# EasyEDA Pro project SCH.epro

# Schematic 【蓝桥杯练习题一】51单片机开发板
Board Name: 【蓝桥杯练习题一】51单片机开发板; Create Date: 2024-11-07; Page Name: SCH; Project Name: 第十三届 蓝桥杯EDA 模拟赛题; Schematic Name: 【蓝桥杯练习题一】51单片机开发板; Update Date: 2024-11-07; Add into BOM: yes; Company: 嘉立创EDA; Convert to PCB: yes; Date: 2020-08-01; Draw By: LCEDA_01; REV: 1.0; Sheet: 1/1
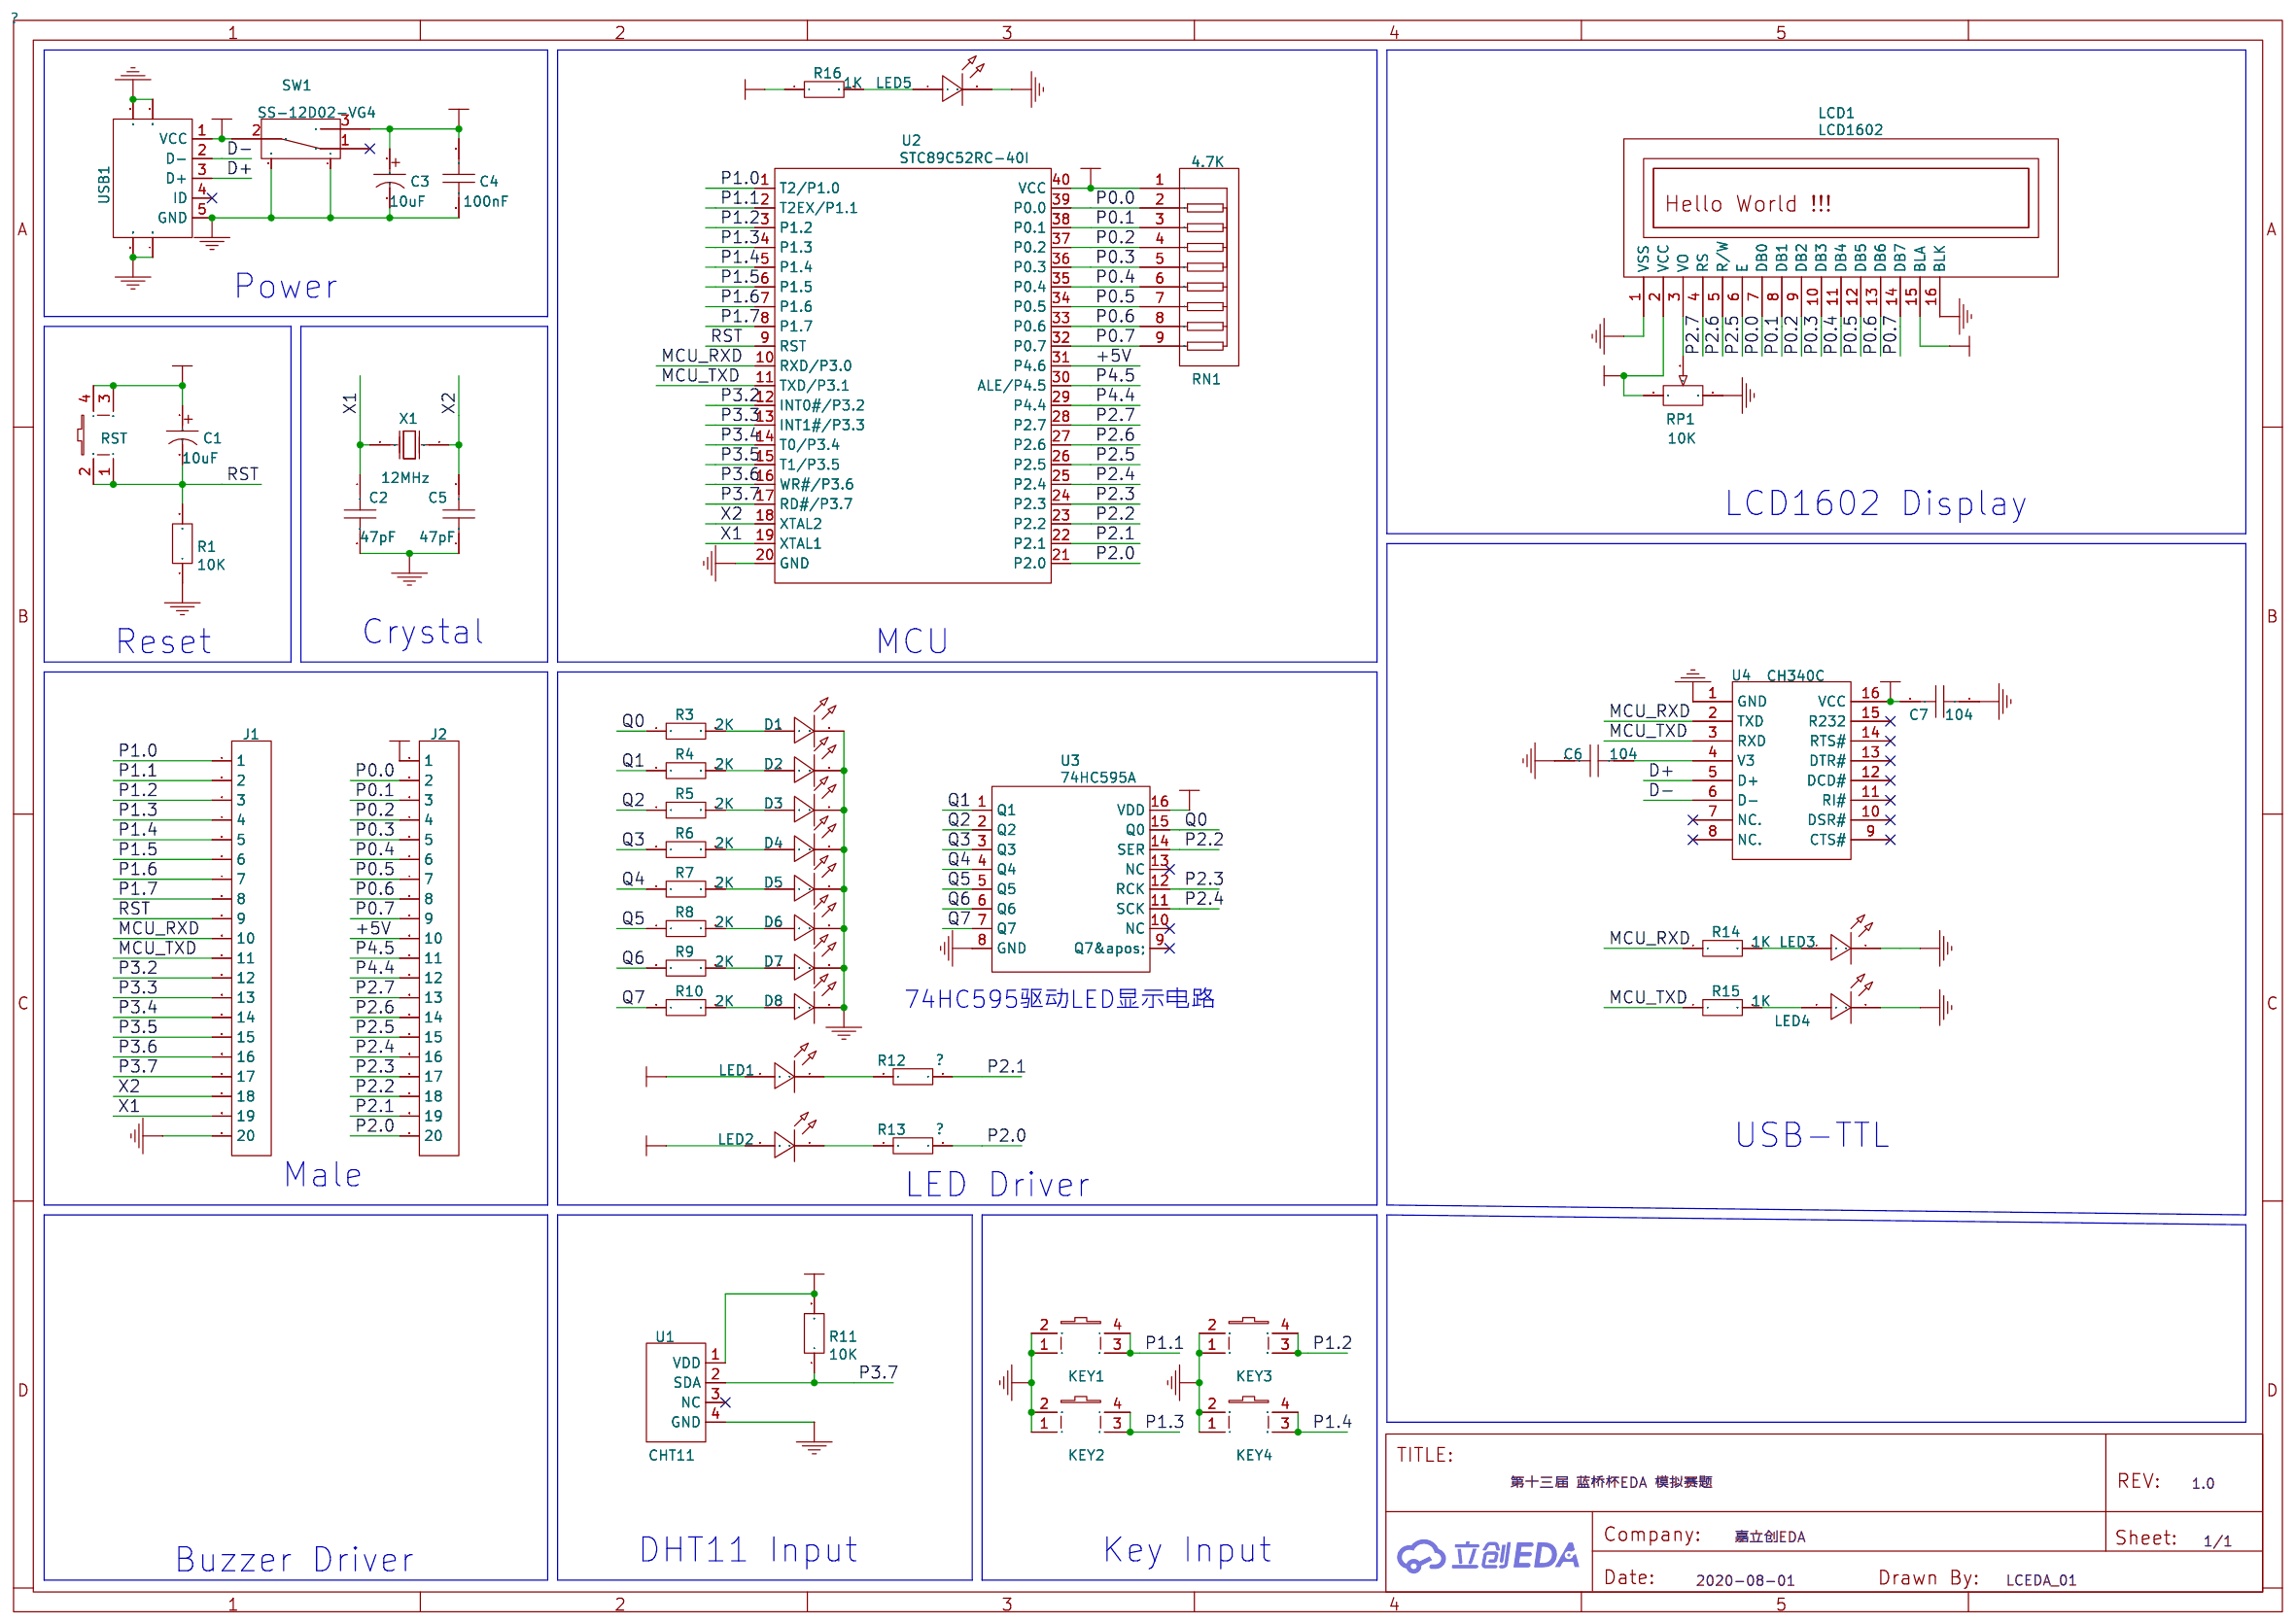
[diagram p0: schematic sheet]

## Parts
C1  10uF
C2  47pF
C3  10uF
C4  100nF
C5  47pF
C6  104
C7  104
D1  LED-0805_B
D2  LED-0805_B
D3  LED-0805_B
D4  LED-0805_B
D5  LED-0805_B
D6  LED-0805_B
D7  LED-0805_B
D8  LED-0805_B
J1  HDR-M-2.54_1x20
J2  HDR-M-2.54_1x20
KEY1  K4-6×6_SMD
KEY2  K4-6×6_SMD
KEY3  K4-6×6_SMD
KEY4  K4-6×6_SMD
LCD1  LCD1602
LED1  LED-TH-3mm_B
LED2  LED-TH-3mm_G
LED3  LED-0805_B
LED4  LED-0805_G
LED5  LED-TH-3mm_R
R1  10K
R3  2K
R4  2K
R5  2K
R6  2K
R7  2K
R8  2K
R9  2K
R10  2K
R11  10K
R12  ？
R13  ？
R14  1K
R15  1K
R16  1K
RN1  4.7K
RP1  10K
RST  K4-6×6_SMD
SW1  SS-12D02-VG4
U1  CHT11
U2  STC89C52RC-40I
U3  74HC595A
U4  CH340C
USB1  USB-Micro_2
X1  12MHz

## Library data of the parts
C1 C3 = 10uF 25V 5*11: Supplier: LCSC; Manufacturer: ValuePro; Supplier Part: C43347
C2 C5 = CC81-N5S2L1B470KSE: Supplier: LCSC; Supplier Part: C278007; Manufacturer: Guangdong Fenghua Advanced Tech
C4 C6 C7 = CC1H104ZA1FD3F5O10MF: Supplier: LCSC; Supplier Part: C254088; Manufacturer: Dersonic
D1-D8 LED3 = D-B080508B1-KS2: Manufacturer: 方舟 ARKLED; Supplier Part: C108412
J1 J2 = HDR-M-2.54_1x20: Supplier Part: C50981; Supplier: LCSC
KEY1-KEY4 RST = K2-6639SP-D4SC-04: Supplier Part: C191626; Supplier: LCSC; Manufacturer: 韩国韩荣
LCD1 = LCM1602K-NSW-BBW: Manufacturer: LONTECH(厦门龙特); Supplier Part: C83275; Supplier: LCSC
LED1 = 204-10SUBC/S400-A4: Manufacturer: EVERLIGHT(台湾亿光); Supplier Part: C86881; Supplier: LCSC
LED2 = 204-10SYGD/S530-E3: Manufacturer: EVERLIGHT(台湾亿光); Supplier Part: C85161
LED4 = NCD0805G1: Manufacturer: 国星光电; Supplier Part: C84260
LED5 = 204-10SDRD/S530-A3-L: Manufacturer: EVERLIGHT(台湾亿光); Supplier Part: C84774; Supplier: LCSC
R1 R11 = RN 1/4W 10K F T/B A1: Supplier: LCSC; Supplier Part: C410695; Manufacturer: TyoHM
R3-R10 R14 R15 = ARG05FTC2001: Supplier: LCSC; Supplier Part: C218483; Manufacturer: Viking Tech; JLCPCB Part Class: Extended Part
R12 R13 R16 = RN1/2WS2KΩFT/BA1: Supplier: LCSC; Supplier Part: C385487; Manufacturer: TyoHM
RN1 = A09-472JP: Supplier: LCSC; Manufacturer: FH; Supplier Part: C9112
RP1 = 10K: Supplier: LCSC; Value(Ω): 10k
SW1 = SS-12D02-VG4: Supplier: LCSC; Supplier Part: C136719; Manufacturer: Rectangular Connectors - Contacts
U1 = CHT11: Supplier: LCSC; Supplier Part: C476208; Manufacturer: CYBERSEN; JLCPCB Part Class: Extended Part
U2 = STC89C52RC-40I: Supplier: LCSC; Manufacturer: STC; image: //image.lceda.cn/szlcsc/C14022.jpg; Supplier Part: C14022
U3 = 74HC595A: Supplier: LCSC; Manufacturer: FM; Supplier Part: C110383; JLCPCB Part Class: Extended Part
U4 = CH340C: Supplier: LCSC; Manufacturer: WCH; Supplier Part: C84681; JLCPCB Part Class: Extend
USB1 = USB-Micro_2: Supplier Part: C40957; Supplier: LCSC; Manufacturer: ValuePro
X1 = B12000J233: Supplier: LCSC; Supplier Part: C258979; Manufacturer: ZheJiang East Crystal Elec

## Nets
+5V: C1.1 C3.1 C4.2 J2.1 J2.10 LCD1.2(VCC) LCD1.15(BLA) LED1.1 LED2.1 R11.2 R16.1 RN1.1 RP1.1 RST.3 RST.4 SW1.3 U1.1(VDD) U2.31(P4.6) U2.40(VCC) U3.16(VDD)
GND: C2.2 C3.2 C4.1 C5.1 C6.2 C7.1 D1.2 D2.2 D3.2 D4.2 D5.2 D6.2 D7.2 D8.2 J1.20 KEY1.1 KEY1.2 KEY2.1 KEY2.2 KEY3.1 KEY3.2 KEY4.1 KEY4.2 LCD1.1(VSS) LCD1.16(BLK) LED3.2 LED4.2 LED5.2 R1.1 RP1.3 SW1.4 SW1.5 U1.4(GND) U2.20(GND) U3.8(GND) U4.1(GND) USB1.5(GND) USB1.6(SH3) USB1.7(SH4) USB1.8(SH1) USB1.9(SH2)
VCC: C7.2 SW1.2 U4.16(VCC) USB1.1(VCC)
D+: U4.5(D+) USB1.3(D+)
D-: U4.6(D-) USB1.2(D-)
MCU_RXD: J1.10 R14.1 U2.10(RXD/P3.0) U4.2(TXD)
MCU_TXD: J1.11 R15.1 U2.11(TXD/P3.1) U4.3(RXD)
P0.0: J2.2 LCD1.7(DB0) RN1.2 U2.39(P0.0)
P0.1: J2.3 LCD1.8(DB1) RN1.3 U2.38(P0.1)
P0.2: J2.4 LCD1.9(DB2) RN1.4 U2.37(P0.2)
P0.3: J2.5 LCD1.10(DB3) RN1.5 U2.36(P0.3)
P0.4: J2.6 LCD1.11(DB4) RN1.6 U2.35(P0.4)
P0.5: J2.7 LCD1.12(DB5) RN1.7 U2.34(P0.5)
P0.6: J2.8 LCD1.13(DB6) RN1.8 U2.33(P0.6)
P0.7: J2.9 LCD1.14(DB7) RN1.9 U2.32(P0.7)
P1.0: J1.1 U2.1(T2/P1.0)
P1.1: J1.2 KEY1.3 KEY1.4 U2.2(T2EX/P1.1)
P1.2: J1.3 KEY3.3 KEY3.4 U2.3(P1.2)
P1.3: J1.4 KEY2.3 KEY2.4 U2.4(P1.3)
P1.4: J1.5 KEY4.3 KEY4.4 U2.5(P1.4)
P1.5: J1.6 U2.6(P1.5)
P1.6: J1.7 U2.7(P1.6)
P1.7: J1.8 U2.8(P1.7)
P2.0: J2.20 R13.2 U2.21(P2.0)
P2.1: J2.19 R12.2 U2.22(P2.1)
P2.2: J2.18 U2.23(P2.2) U3.14(SER)
P2.3: J2.17 U2.24(P2.3) U3.12(RCK)
P2.4: J2.16 U2.25(P2.4) U3.11(SCK)
P2.5: J2.15 LCD1.6(E) U2.26(P2.5)
P2.6: J2.14 LCD1.5(R/W) U2.27(P2.6)
P2.7: J2.13 LCD1.4(RS) U2.28(P2.7)
P3.2: J1.12 U2.12(INT0#/P3.2)
P3.3: J1.13 U2.13(INT1#/P3.3)
P3.4: J1.14 U2.14(T0/P3.4)
P3.5: J1.15 U2.15(T1/P3.5)
P3.6: J1.16 U2.16(WR#/P3.6)
P3.7: J1.17 R11.1 U1.2(SDA) U2.17(RD#/P3.7)
P4.4: J2.12 U2.29(P4.4)
P4.5: J2.11 U2.30(ALE/P4.5)
Q0: R3.1 U3.15(Q0)
Q1: R4.1 U3.1(Q1)
Q2: R5.1 U3.2(Q2)
Q3: R6.1 U3.3(Q3)
Q4: R7.1 U3.4(Q4)
Q5: R8.1 U3.5(Q5)
Q6: R9.1 U3.6(Q6)
Q7: R10.1 U3.7(Q7)
RST: C1.2 J1.9 R1.2 RST.1 RST.2 U2.9(RST)
X1: C2.1 J1.19 U2.19(XTAL1) X1.2(OSC2)
X2: C5.2 J1.18 U2.18(XTAL2) X1.1(OSC1)
Net-(C6-1): C6.1 U4.4(V3)
Net-(D1-1): D1.1 R3.2
Net-(D2-1): D2.1 R4.2
Net-(D3-1): D3.1 R5.2
Net-(D4-1): D4.1 R6.2
Net-(D5-1): D5.1 R7.2
Net-(D6-1): D6.1 R8.2
Net-(D7-1): D7.1 R9.2
Net-(D8-1): D8.1 R10.2
Net-(LCD1-3): LCD1.3(VO) RP1.2
Net-(LED1-2): LED1.2 R12.1
Net-(LED2-2): LED2.2 R13.1
Net-(LED3-1): LED3.1 R14.2
Net-(LED4-1): LED4.1 R15.2
Net-(LED5-1): LED5.1 R16.2

Not connected (* = marked no-connect by the designer): SW1 1*; U1 3(NC)*; U3 9(Q7&apos;)* 10(NC)* 13(NC)*; U4 7(NC.)* 8(NC.)* 9(CTS#)* 10(DSR#)* 11(RI#)* 12(DCD#)* 13(DTR#)* 14(RTS#)* 15(R232)*; USB1 4(ID)*

## Notes on the sheet
- Power
- LCD1602 Display
- Reset
- Crystal
- MCU
- 74HC595驱动LED显示电路
- USB-TTL
- Male
- LED Driver
- DHT11 Input
- Key Input
- Buzzer Driver
